# Altium schematic sheet Phase Voltage Dividers.SchDoc: 3 Phase Voltage Dividers
size 292 x 193 mm; SheetNumber: 10; SheetTotal: 12
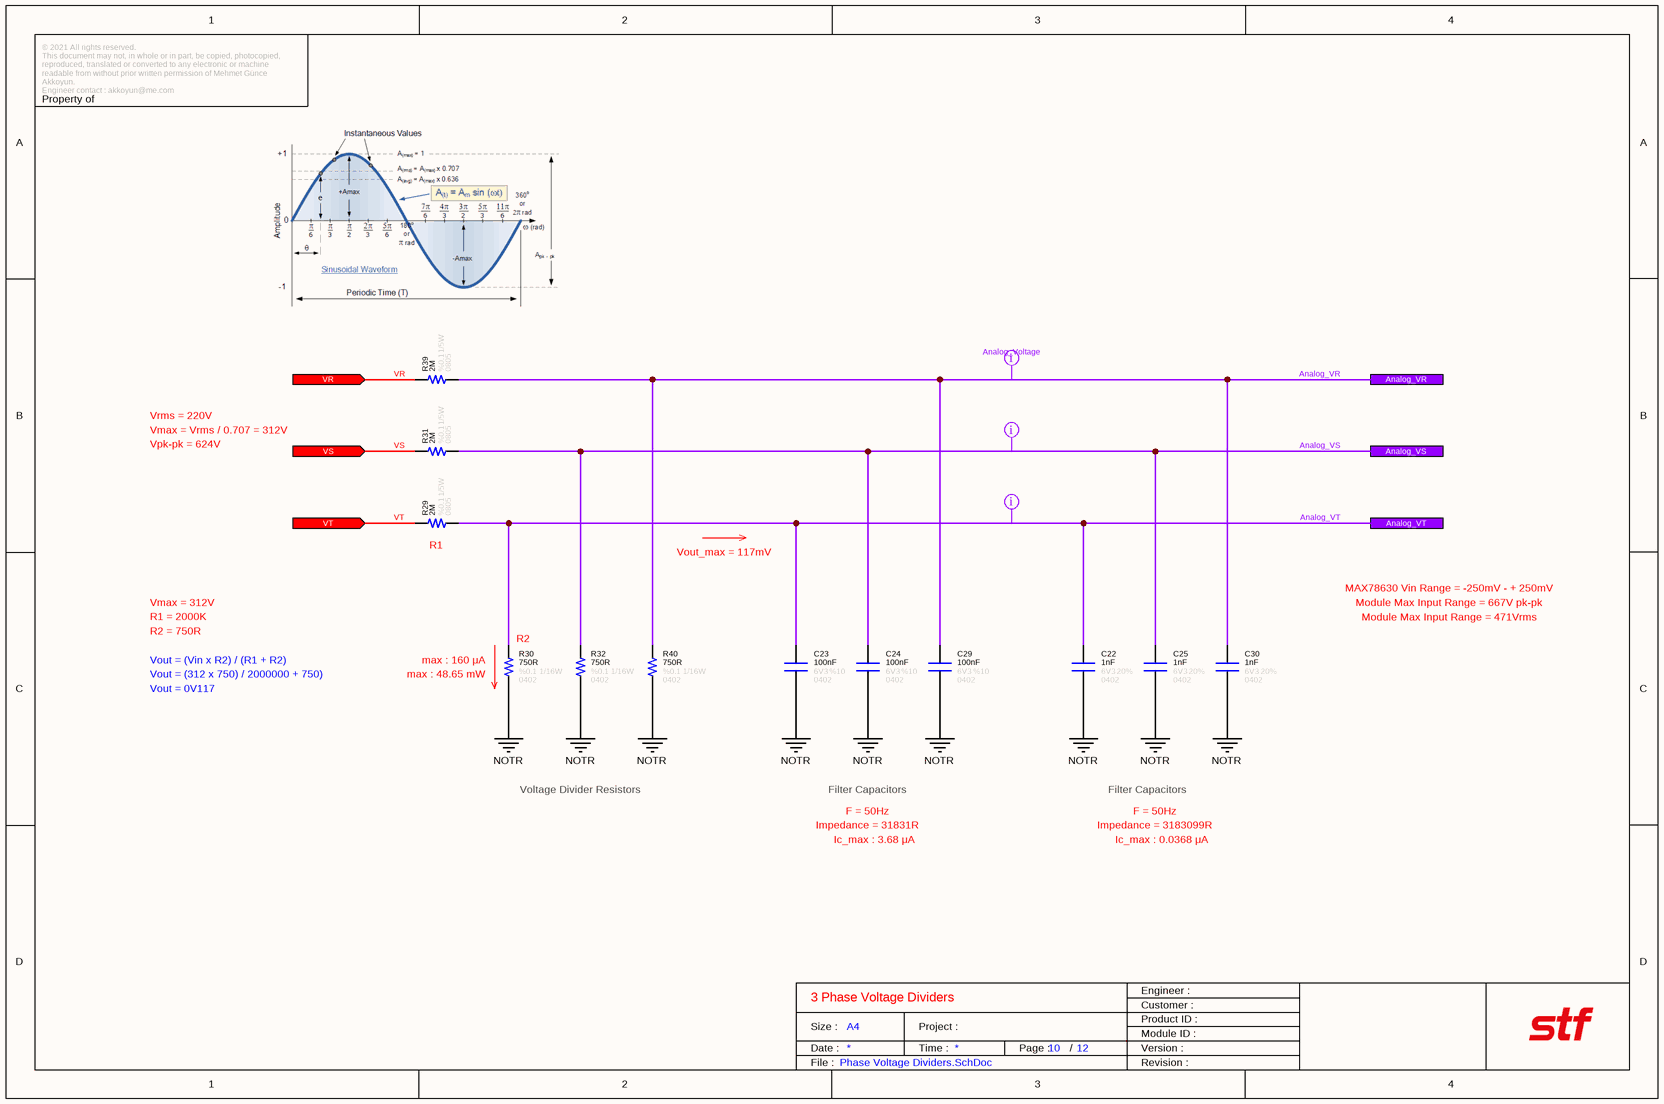
[diagram p0: Phase Voltage Dividers.SchDoc]

## Parts
C22  value 1nF  Tolerance: 20%  Case: 0402  Voltage: 6V3  [CAPACITOR_0402]  (hidden comment: Capacitor - 1nF [0402] (Ceramic))
C23  value 100nF  Tolerance: %10  Voltage: 6V3  Case: 0402  [CAPACITOR_0402]  (hidden comment: Capacitor - 100nF [0402] (Ceramic))
C24  value 100nF  Tolerance: %10  Voltage: 6V3  Case: 0402  [CAPACITOR_0402]  (hidden comment: Capacitor - 100nF [0402] (Ceramic))
C25  value 1nF  Tolerance: 20%  Case: 0402  Voltage: 6V3  [CAPACITOR_0402]  (hidden comment: Capacitor - 1nF [0402] (Ceramic))
C29  value 100nF  Tolerance: %10  Voltage: 6V3  Case: 0402  [CAPACITOR_0402]  (hidden comment: Capacitor - 100nF [0402] (Ceramic))
C30  value 1nF  Tolerance: 20%  Case: 0402  Voltage: 6V3  [CAPACITOR_0402]  (hidden comment: Capacitor - 1nF [0402] (Ceramic))
R29  value 2M  Case: 0805  Tolerance: %0.1  Power: 1/5W  [RESISTOR_0805]  (hidden comment: 2M - 0805 - %0.1 - 1/5W)
R30  value 750R  Case: 0402  Tolerance: %0.1  Power: 1/16W  [RESISTOR_0402]  (hidden comment: 750R - 0402 - %0.1 - 1/16W)
R31  value 2M  Case: 0805  Tolerance: %0.1  Power: 1/5W  [RESISTOR_0805]  (hidden comment: 2M - 0805 - %0.1 - 1/5W)
R32  value 750R  Case: 0402  Tolerance: %0.1  Power: 1/16W  [RESISTOR_0402]  (hidden comment: 750R - 0402 - %0.1 - 1/16W)
R39  value 2M  Case: 0805  Tolerance: %0.1  Power: 1/5W  [RESISTOR_0805]  (hidden comment: 2M - 0805 - %0.1 - 1/5W)
R40  value 750R  Case: 0402  Tolerance: %0.1  Power: 1/16W  [RESISTOR_0402]  (hidden comment: 750R - 0402 - %0.1 - 1/16W)

## Ports
Analog_VR, Analog_VS, Analog_VT, VR (in), VS (in), VT (in)

## Nets
NOTR: C22.1 C23.1 C24.1 C25.1 C29.1 C30.1 R30.1 R32.1 R40.1
Analog_VR: C29.2 C30.2 R39.1 R40.2 ; port Analog_VR
Analog_VS: C24.2 C25.2 R31.1 R32.2 ; port Analog_VS
Analog_VT: C22.2 C23.2 R29.1 R30.2 ; port Analog_VT
VR: R39.2 ; port VR
VS: R31.2 ; port VS
VT: R29.2 ; port VT

## Layout directives
net class Analog_Voltage: Analog_VR, Analog_VS, Analog_VT

## Notes on the sheet
- Vrms = 220V
- Vmax = Vrms / 0.707 = 312V
- Vpk-pk = 624V
- (near R29) R1
- Vout_max = 117mV
- Vmax = 312V
- R1 = 2000K
- MAX78630 Vin Range = -250mV - + 250mV
- Module Max Input Range = 667V pk-pk
- Module Max Input Range = 471Vrms
- Vout = (Vin x R2) / (R1 + R2)
- R2 = 750R
- Vout = (312 x 750) / 2000000 + 750)
- Vout = 0V117
- (near R30) max : 160 μA
- (near R30) max : 48.65 mW
- (near R30) R2
- Voltage Divider Resistors
- Filter Capacitors
- F = 50Hz
- Impedance = 31831R
- Ic_max : 3.68 μA
- Impedance = 3183099R
- Ic_max : 0.0368 μA
- © 2021 All rights reserved.
  This document may not, in whole or in part, be copied, photocopied, reproduced, translated or converted to any electronic or machine readable from without prior written permission of Mehmet Günce Akkoyun.
  Engineer contact : akkoyun@me.com
- Property of
- Engineer :
- Date :
- Size :
- A4
- Time :
- Project :
- Page :
- /
- Customer :
- Product ID :
- Module ID :
- Version :
- File :
- Revision :

## Library data of the parts
C22 C25 C30 = Capacitor - 1nF [0402-6V3]: Manufacturer Name: AVX; Manufacturer Part Number: 04026C102MAT2A; ComponentLink1Description: DataSheet; ComponentLink1URL: https://www.mouser.com.tr/datasheet/2/40/X7RDielectric-777024.pdf
C23 C24 C29 = Capacitor - 100nF [0402-6V3]: Capacitor - 100nF [0402-6V3] (Ceramic); Manufacturer Name: AVX; Manufacturer Part Number: 04026D104KAT4A; ComponentLink1Description: Mouser; ComponentLink1URL: https://www.mouser.com.tr/ProductDetail/AVX/04026D104KAT4A?qs=sGAEpiMZZMs0AnBnWHyRQPg4iYkCw7IMED%2F4kpqgf7w%3D; ComponentLink2Description: DataSheet; ComponentLink2URL: https://www.mouser.com.tr/datasheet/2/40/cx5r-776519.pdf
R29 R31 R39 = Resistor - 2M [0805] %0.1: Thick Film Resistors - SMD 1/5 W 2 MOhm 0.1%; Manufacturer Name: Vishay; Manufacturer Part Number: MCU0805MD2004BP500; ComponentLink1Description: DataSheet; ComponentLink1URL: https://www.mouser.com.tr/datasheet/2/427/dcrcwe3-1762152.pdf; ComponentLink2Description: Mouser; ComponentLink2URL: https://www.mouser.com.tr/ProductDetail/Vishay-Dale/CRCW0402330RFKED?qs=sGAEpiMZZMu61qfTUdNhG2DpbjADlD3GGS6SwBlLi5Q%3D
R30 R32 R40 = Resistor - 750R [0402] %0.1: Thick Film Resistors - SMD 1/16 W 750 Ohm 0.1%; Manufacturer Name: Vishay; Manufacturer Part Number: MCS04020D7500BE000; ComponentLink1Description: DataSheet; ComponentLink1URL: https://www.mouser.com.tr/datasheet/2/427/dcrcwe3-1762152.pdf; ComponentLink2Description: Mouser; ComponentLink2URL: https://www.mouser.com.tr/ProductDetail/Vishay-Dale/CRCW0402330RFKED?qs=sGAEpiMZZMu61qfTUdNhG2DpbjADlD3GGS6SwBlLi5Q%3D